# Altium schematic sheet Sheet3.SchDoc
size A4
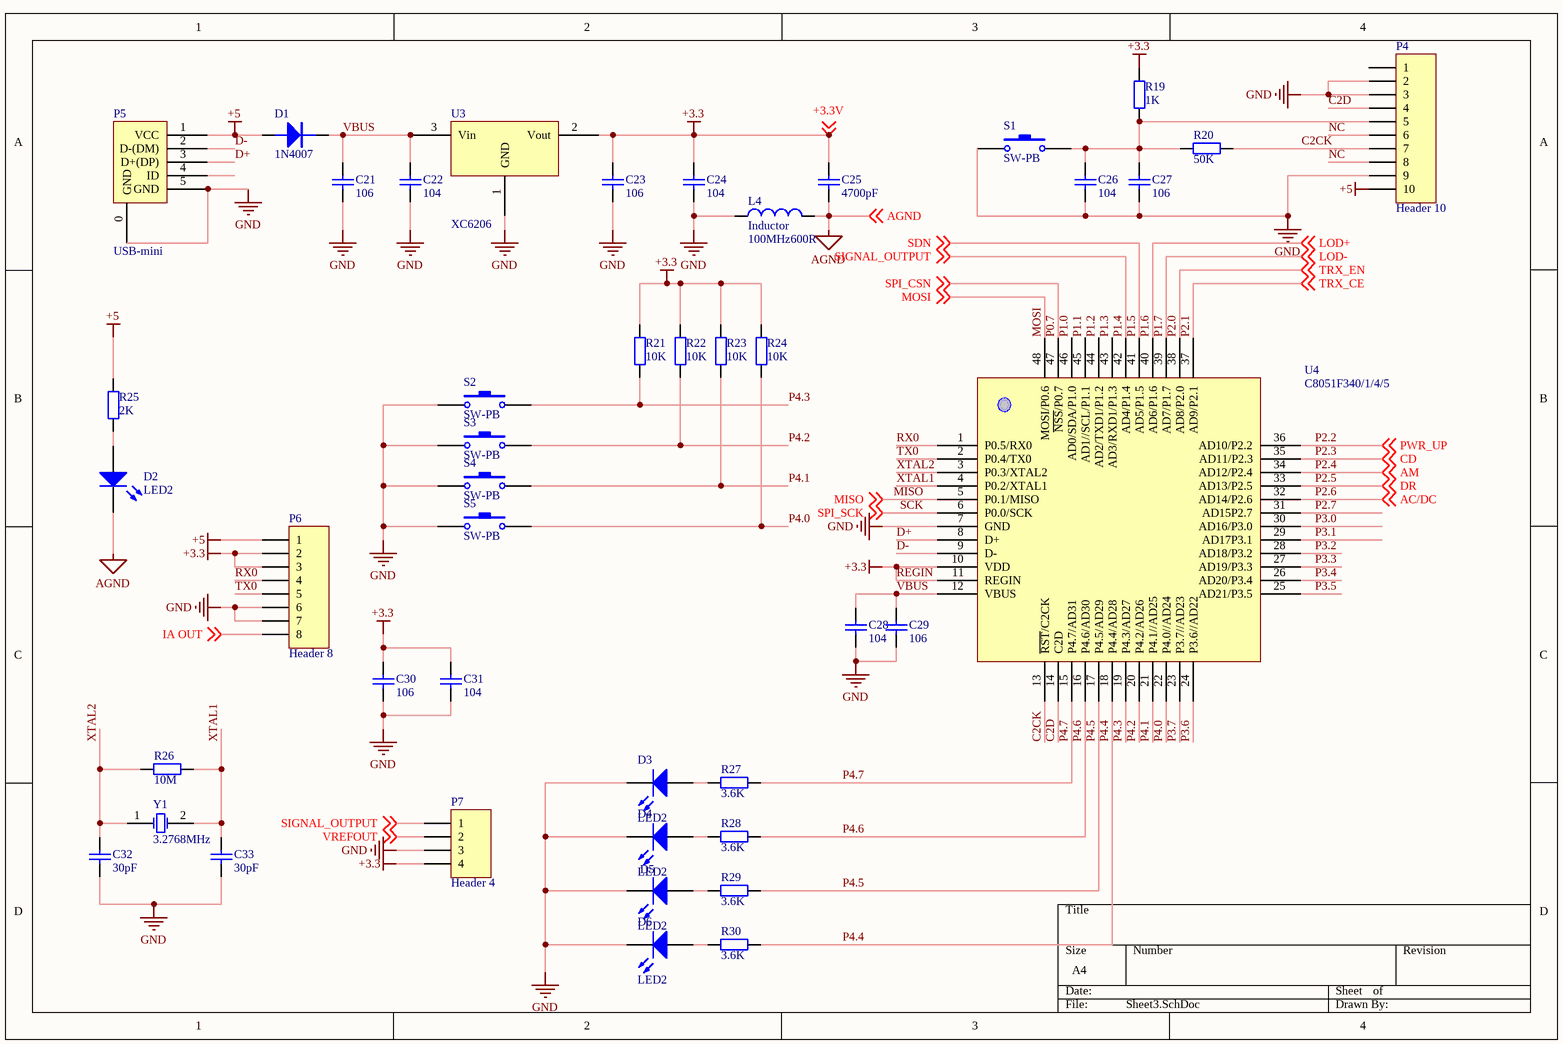
[diagram p0: Sheet3.SchDoc]

## Parts
C21  106  [0603C]
C22  104  [0603C]
C23  106  [0603C]
C24  104  [0603C]
C25  4700pF  [0603C]
C26  104  [0603C]
C27  106  [0603C]
C28  104  [0603C]
C29  106  [0603C]
C30  106  [0603C]
C31  104  [0603C]
C32  30pF  [0603C]
C33  30pF  [0603C]
D1  1N4007  [0603-D]
D2  LED2  [0603-D]
D3  LED2  [LED0805R]
D4  LED2  [LED0805R]
D5  LED2  [LED0805R]
D6  LED2  [LED0805R]
L4  Inductor  value 100MHz600R  [0603]
P4  Header 10  [IDC10L]
P5  USB-mini  [USB-Micro]
P6  Header 8  [HDR1X8]
P7  Header 4  [HDR1X4]
R19  1K  [0603R]
R20  50K  [0603R]
R21  10K  [0603R]
R22  10K  [0603R]
R23  10K  [0603R]
R24  10K  [0603R]
R25  2K  [0603R]
R26  10M  [0603R]
R27  3.6K  [0603R]
R28  3.6K  [0603R]
R29  3.6K  [0603R]
R30  3.6K  [0603R]
S1  SW-PB  [SW-BP-SMD]
S2  SW-PB  [SW-BP-SMD]
S3  SW-PB  [SW-BP-SMD]
S4  SW-PB  [SW-BP-SMD]
S5  SW-PB  [SW-BP-SMD]
U3  XC6206  [SOT-23-123]
U4  C8051F340/1/4/5  [TQFP48_M]
Y1  3.2768MHz  [CY2]

## Nets
+5: D1.A P4.10 P5.1(VCC) P6.1 R25.2
AGND: C25.1 D2.K L4.2 ; off-sheet AGND
GND: C21.1 C22.1 C23.1 C24.1 C26.1 C27.1 C28.1 C29.1 C30.1 C31.1 C32.1 C33.1 D3.2 D4.2 D5.2 D6.2 L4.1 P4.2 P4.3 P4.9 P5.0(GND) P5.5(GND) P6.6 P6.7 P7.3 S1.1 S2.1 S3.1 S4.1 S5.1 U3.1(GND) U4.7(GND)
REGIN: C23.2 C24.2 C25.2 C30.2 C31.2 P6.2 P6.3 P7.4 R19.2 R21.2 R22.2 R23.2 R24.2 U3.2(Vout) U4.10(VDD) U4.11(REGIN) ; off-sheet +3.3V  [also labelled +3.3, +3.3V]
C2CK: P4.7 R20.1 U4.13(~{RST}/C2CK)
C2D: P4.4 U4.14(C2D)
D+: P5.3(D+(DP)) U4.8(D+)
D-: P5.2(D-(DM)) U4.9(D-)
IA OUT: P6.8 ; off-sheet IA OUT
MISO: U4.5(P0.1/MISO) ; off-sheet MISO
MOSI: U4.48(MOSI/P0.6) ; off-sheet MOSI
NC: P4.6 P4.8
P0.7: U4.47(~{NSS}/P0.7) ; off-sheet SPI_CSN  [also labelled SPI_CSN]
P1.0: U4.46(AD0/SDA/P1.0)
P1.1: U4.45(AD1//SCL/P1.1)
P1.2: U4.44(AD2/TXD1/P1.2)
P1.3: U4.43(AD3/RXD1/P1.3)
P1.4: P7.1 U4.42(AD4/P1.4) ; off-sheet SIGNAL_OUTPUT  [also labelled SIGNAL_OUTPUT]
P1.5: U4.41(AD5/P1.5) ; off-sheet SDN  [also labelled SDN]
P1.6: U4.40(AD6/P1.6) ; off-sheet LOD+  [also labelled LOD+]
P1.7: U4.39(AD7/P1.7) ; off-sheet LOD-  [also labelled LOD-]
P2.0: U4.38(AD8/P2.0) ; off-sheet TRX_EN  [also labelled TRX_EN]
P2.1: U4.37(AD9/P2.1) ; off-sheet TRX_CE  [also labelled TRX_CE]
P2.2: U4.36(AD10/P2.2) ; off-sheet PWR_UP  [also labelled PWR_UP]
P2.3: U4.35(AD11/P2.3) ; off-sheet CD  [also labelled CD]
P2.4: U4.34(AD12/P2.4) ; off-sheet AM  [also labelled AM]
P2.5: U4.33(AD13/P2.5) ; off-sheet DR  [also labelled DR]
P2.6: U4.32(AD14/P2.6) ; off-sheet AC/DC  [also labelled AC/DC]
P2.7: U4.31(AD15P2.7)
P3.0: U4.30(AD16/P3.0)
P3.1: U4.29(AD17P3.1)
P3.2: U4.28(AD18/P3.2)
P3.3: U4.27(AD19/P3.3)
P3.4: U4.26(AD20/P3.4)
P3.5: U4.25(AD21/P3.5)
P3.6: U4.24(P3.6//AD22)
P3.7: U4.23(P3.7//AD23)
P4.0: R24.1 S5.2 U4.22(P4.0//AD24)
P4.1: R23.1 S4.2 U4.21(P4.1//AD25)
P4.2: R22.1 S3.2 U4.20(P4.2/AD26)
P4.3: R21.1 S2.2 U4.19(P4.3/AD27)
P4.4: R30.2 U4.18(P4.4/AD28)
P4.5: R29.2 U4.17(P4.5/AD29)
P4.6: R28.2 U4.16(P4.6/AD30)
P4.7: R27.2 U4.15(P4.7/AD31)
RX0: P6.4 U4.1(P0.5/RX0)
SCK: U4.6(P0.0/SCK) ; off-sheet SPI_SCK  [also labelled SPI_SCK]
TX0: P6.5 U4.2(P0.4/TX0)
VBUS: C21.2 C22.2 C28.2 C29.2 D1.K U3.3(Vin) U4.12(VBUS)
VREFOUT: P7.2 ; off-sheet VREFOUT
XTAL1: C33.2 R26.2 U4.4(P0.2/XTAL1) Y1.2(OSC2)
XTAL2: C32.2 R26.1 U4.3(P0.3/XTAL2) Y1.1(OSC1)
NetC26_2: C26.2 C27.2 P4.5 R19.1 R20.2 S1.2
NetD2_A: D2.A R25.1
NetD3_1: D3.1 R27.1
NetD4_1: D4.1 R28.1
NetD5_1: D5.1 R29.1
NetD6_1: D6.1 R30.1

Not connected (* = marked no-connect by the designer): P4 1; P5 4(ID)

## Library data of the parts
C21-C24 C26-C33 = Cap: Capacitor; Value: 4700pF; Published: 8-Jun-2000; LatestRevisionDate: 17-Jul-2002; LatestRevisionNote: Re-released for DXP Platform.; PackageReference: RAD-0.3; Publisher: Altium Limited; PackageDescription: Radial Cap, Thru-Hole; 2 Leads; 0.3 in Pin Spacing
C25 = Cap: Capacitor; Published: 8-Jun-2000; LatestRevisionDate: 17-Jul-2002; LatestRevisionNote: Re-released for DXP Platform.; PackageReference: RAD-0.3; Publisher: Altium Limited; PackageDescription: Radial Cap, Thru-Hole; 2 Leads; 0.3 in Pin Spacing; Value: 4700pF
D1 = DIODE
D2-D6 = LED2: Typical RED, GREEN, YELLOW, AMBER GaAs LED; Published: 8-Jun-2000; LatestRevisionDate: 17-Jul-2002; LatestRevisionNote: Re-released for DXP Platform.; PackageVersion: Feb-2002; PackageReference: 3.2X1.6X1.1; Publisher: Altium Limited; PackageDescription: SM LED; 2 Flat Leads
L4 = Inductor: Code_IEC: 1005; Published: 8-Jun-2000; LatestRevisionDate: 29-May-2009; LatestRevisionNote: IPC-7351 Footprint Added.; PackageReference: 0402-A; Publisher: Altium Limited; PackageDescription: Chip Inductor; Code_JEITA: 0402
P4 = Header 10: Header, 10-Pin; LatestRevisionDate: 17-Jul-2002; LatestRevisionNote: Re-released for DXP Platform.; Publisher: Altium Limited
P6 = Header 8: Header, 8-Pin; LatestRevisionDate: 17-Jul-2002; LatestRevisionNote: Re-released for DXP Platform.; Publisher: Altium Limited
P7 = Header 4: Header, 4-Pin; LatestRevisionDate: 17-Jul-2002; LatestRevisionNote: Re-released for DXP Platform.; Publisher: Altium Limited
R19 R21-R30 = Res2: Resistor; Value: 50K; Published: 8-Jun-2000; LatestRevisionDate: 17-Jul-2002; LatestRevisionNote: Re-released for DXP Platform.; PackageReference: AXIAL-0.4; Publisher: Altium Limited; PackageDescription: Axial Device, Thru-Hole; 2 Leads; 0.4 in Pin Spacing
R20 = Res2: Resistor; Published: 8-Jun-2000; LatestRevisionDate: 17-Jul-2002; LatestRevisionNote: Re-released for DXP Platform.; PackageReference: AXIAL-0.4; Publisher: Altium Limited; PackageDescription: Axial Device, Thru-Hole; 2 Leads; 0.4 in Pin Spacing; Value: 50K
S1-S5 = SW-PB: Switch; Published: 24-Mar-1999; LatestRevisionDate: 17-Jul-2002; LatestRevisionNote: Re-released for DXP Platform.; PackageReference: SPST-2; Publisher: Altium Limited; PackageDescription: Switch; 2 Leads
Y1 = XTAL: Crystal Oscillator; Published: 8-Jun-2000; LatestRevisionDate: 17-Jul-2002; LatestRevisionNote: Re-released for DXP Platform.; PackageReference: R38; Publisher: Altium Limited; PackageDescription: Crystal, Thru-Hole; 2 Leads; Body 3.1 x 8.2 mm (Dia.xH)